# Altium schematic sheet 3 MXM Connector 1.SchDoc: MXM Connector
size C; DocumentNumber: 2; SheetNumber: 2; SheetTotal: 16
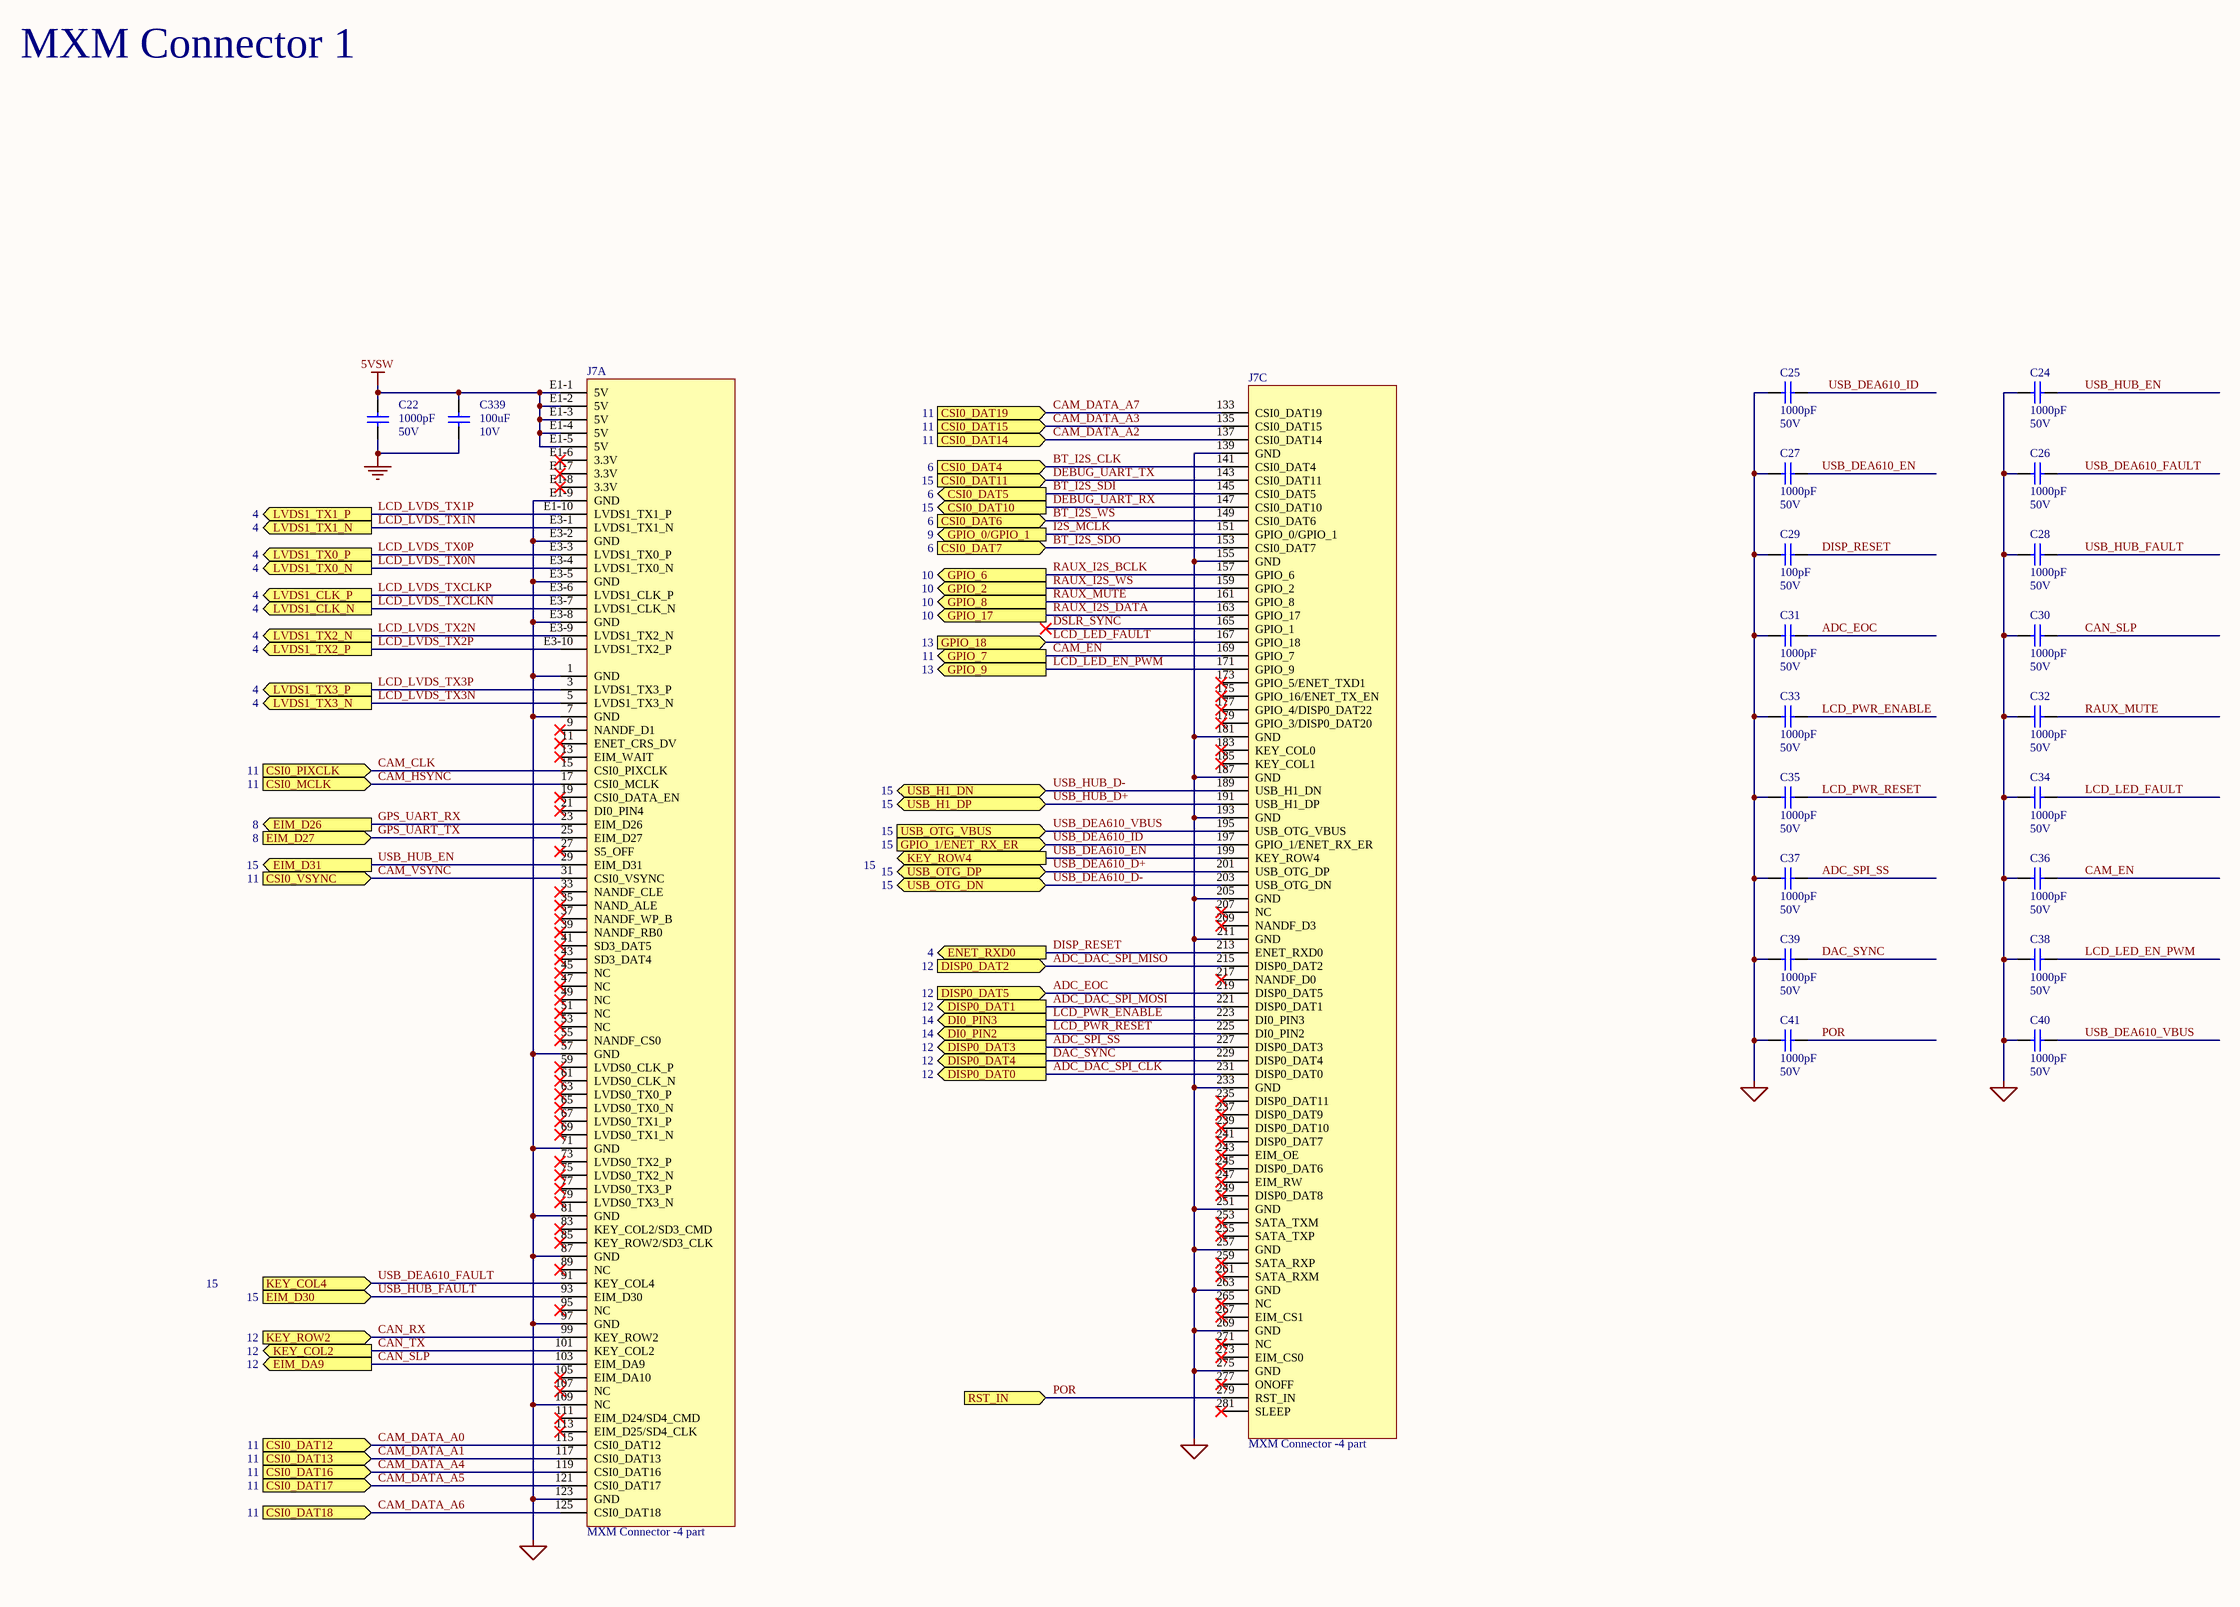
[diagram p0: 3 MXM Connector 1.SchDoc]

## Parts
C22  value 1000pF  Voltage: 50V  [CAP_0603]  (hidden comment: Cap 1000pF 50V 0603)
C24  value 1000pF  Voltage: 50V  [CAP_0603]  (hidden comment: Cap 1000pF 50V 0603)
C25  value 1000pF  Voltage: 50V  [CAP_0603]  (hidden comment: Cap 1000pF 50V 0603)
C26  value 1000pF  Voltage: 50V  [CAP_0603]  (hidden comment: Cap 1000pF 50V 0603)
C27  value 1000pF  Voltage: 50V  [CAP_0603]  (hidden comment: Cap 1000pF 50V 0603)
C28  value 1000pF  Voltage: 50V  [CAP_0603]  (hidden comment: Cap 1000pF 50V 0603)
C29  value 100pF  Voltage: 50V  [CAP_0402]  (hidden comment: Cap 100pF 50V 0402)
C30  value 1000pF  Voltage: 50V  [CAP_0603]  (hidden comment: Cap 1000pF 50V 0603)
C31  value 1000pF  Voltage: 50V  [CAP_0603]  (hidden comment: Cap 1000pF 50V 0603)
C32  value 1000pF  Voltage: 50V  [CAP_0603]  (hidden comment: Cap 1000pF 50V 0603)
C33  value 1000pF  Voltage: 50V  [CAP_0603]  (hidden comment: Cap 1000pF 50V 0603)
C34  value 1000pF  Voltage: 50V  [CAP_0603]  (hidden comment: Cap 1000pF 50V 0603)
C35  value 1000pF  Voltage: 50V  [CAP_0603]  (hidden comment: Cap 1000pF 50V 0603)
C36  value 1000pF  Voltage: 50V  [CAP_0603]  (hidden comment: Cap 1000pF 50V 0603)
C37  value 1000pF  Voltage: 50V  [CAP_0603]  (hidden comment: Cap 1000pF 50V 0603)
C38  value 1000pF  Voltage: 50V  [CAP_0603]  (hidden comment: Cap 1000pF 50V 0603)
C39  value 1000pF  Voltage: 50V  [CAP_0603]  (hidden comment: Cap 1000pF 50V 0603)
C40  value 1000pF  Voltage: 50V  [CAP_0603]  (hidden comment: Cap 1000pF 50V 0603)
C41  value 1000pF  Voltage: 50V  [CAP_0603]  (hidden comment: Cap 1000pF 50V 0603)
C339  value 100uF  Voltage: 10V  [CAP_1210]  (hidden comment: Cap 100uF 10V 1210)
J7  MXM Connector -4 part  [CON_CLE9990-0402F]  (parts A,C of 4)

## Ports
CSI0_DAT4 (in, see 6), CSI0_DAT5 (out, see 6), CSI0_DAT6 (in, see 6), CSI0_DAT7 (in, see 6), CSI0_DAT10 (out, see 15), CSI0_DAT11 (in, see 15), CSI0_DAT12 (in, see 11), CSI0_DAT13 (in, see 11), CSI0_DAT14 (in, see 11), CSI0_DAT15 (in, see 11), CSI0_DAT16 (in, see 11), CSI0_DAT17 (in, see 11), CSI0_DAT18 (in, see 11), CSI0_DAT19 (in, see 11), CSI0_MCLK (in, see 11), CSI0_PIXCLK (in, see 11), CSI0_VSYNC (in, see 11), DI0_PIN2 (out, see 14), DI0_PIN3 (out, see 14), DISP0_DAT0 (out, see 12), DISP0_DAT1 (out, see 12), DISP0_DAT2 (in, see 12), DISP0_DAT3 (out, see 12), DISP0_DAT4 (out, see 12), DISP0_DAT5 (in, see 12), EIM_D26 (out, see 8), EIM_D27 (in, see 8), EIM_D30 (in, see 15), EIM_D31 (out, see 15), EIM_DA9 (out, see 12), ENET_RXD0 (out, see 4), GPIO_0/GPIO_1 (out, see 9), GPIO_1/ENET_RX_ER (in, see 15), GPIO_2 (out, see 10), GPIO_6 (out, see 10), GPIO_7 (out, see 11), GPIO_8 (out, see 10), GPIO_9 (out, see 13), GPIO_17 (out, see 10), GPIO_18 (in, see 13), KEY_COL2 (out, see 12), KEY_COL4 (in, see 15), KEY_ROW2 (in, see 12), KEY_ROW4 (out, see 15), LVDS1_CLK_N (out, see 4), LVDS1_CLK_P (out, see 4), LVDS1_TX0_N (out, see 4), LVDS1_TX0_P (out, see 4), LVDS1_TX1_N (out, see 4), LVDS1_TX1_P (out, see 4), LVDS1_TX2_N (out, see 4), LVDS1_TX2_P (out, see 4), LVDS1_TX3_N (out, see 4), LVDS1_TX3_P (out, see 4), RST_IN (in), USB_H1_DN (bidir, see 15), USB_H1_DP (bidir, see 15), USB_OTG_DN (bidir, see 15), USB_OTG_DP (bidir, see 15), USB_OTG_VBUS (in, see 15)

## Nets
5VSW: C22.1 C339.1 J7.E1-1(5V) J7.E1-2(5V) J7.E1-3(5V) J7.E1-4(5V) J7.E1-5(5V)
GND: C22.2 C24.2 C25.2 C26.2 C27.2 C28.2 C29.2 C30.2 C31.2 C32.2 C33.2 C34.2 C35.2 C36.2 C37.2 C38.2 C39.2 C40.2 C41.2 C339.2 J7.1(GND) J7.7(GND) J7.57(GND) J7.71(GND) J7.81(GND) J7.87(GND) J7.97(GND) J7.109(NC) J7.123(GND) J7.139(GND) J7.155(GND) J7.181(GND) J7.187(GND) J7.193(GND) J7.205(GND) J7.211(GND) J7.233(GND) J7.251(GND) J7.257(GND) J7.263(GND) J7.269(GND) J7.275(GND) J7.E1-9(GND) J7.E3-2(GND) J7.E3-5(GND) J7.E3-8(GND)
ADC_DAC_SPI_CLK: J7.231(DISP0_DAT0) ; port DISP0_DAT0
ADC_DAC_SPI_MISO: J7.215(DISP0_DAT2) ; port DISP0_DAT2
ADC_DAC_SPI_MOSI: J7.221(DISP0_DAT1) ; port DISP0_DAT1
ADC_EOC: C31.1 J7.219(DISP0_DAT5) ; port DISP0_DAT5
ADC_SPI_SS: C37.1 J7.227(DISP0_DAT3) ; port DISP0_DAT3
BT_I2S_CLK: J7.141(CSI0_DAT4) ; port CSI0_DAT4
BT_I2S_SDI: J7.145(CSI0_DAT5) ; port CSI0_DAT5
BT_I2S_SDO: J7.153(CSI0_DAT7) ; port CSI0_DAT7
BT_I2S_WS: J7.149(CSI0_DAT6) ; port CSI0_DAT6
CAM_CLK: J7.15(CSI0_PIXCLK) ; port CSI0_PIXCLK
CAM_DATA_A0: J7.115(CSI0_DAT12) ; port CSI0_DAT12
CAM_DATA_A1: J7.117(CSI0_DAT13) ; port CSI0_DAT13
CAM_DATA_A2: J7.137(CSI0_DAT14) ; port CSI0_DAT14
CAM_DATA_A3: J7.135(CSI0_DAT15) ; port CSI0_DAT15
CAM_DATA_A4: J7.119(CSI0_DAT16) ; port CSI0_DAT16
CAM_DATA_A5: J7.121(CSI0_DAT17) ; port CSI0_DAT17
CAM_DATA_A6: J7.125(CSI0_DAT18) ; port CSI0_DAT18
CAM_DATA_A7: J7.133(CSI0_DAT19) ; port CSI0_DAT19
CAM_EN: C36.1 J7.169(GPIO_7) ; port GPIO_7
CAM_HSYNC: J7.17(CSI0_MCLK) ; port CSI0_MCLK
CAM_VSYNC: J7.31(CSI0_VSYNC) ; port CSI0_VSYNC
CAN_RX: J7.99(KEY_ROW2) ; port KEY_ROW2
CAN_SLP: C30.1 J7.103(EIM_DA9) ; port EIM_DA9
CAN_TX: J7.101(KEY_COL2) ; port KEY_COL2
DAC_SYNC: C39.1 J7.229(DISP0_DAT4) ; port DISP0_DAT4
DEBUG_UART_RX: J7.147(CSI0_DAT10) ; port CSI0_DAT10
DEBUG_UART_TX: J7.143(CSI0_DAT11) ; port CSI0_DAT11
DISP_RESET: C29.1 J7.213(ENET_RXD0) ; port ENET_RXD0
DSLR_SYNC: J7.165(GPIO_1)
GPS_UART_RX: J7.23(EIM_D26) ; port EIM_D26
GPS_UART_TX: J7.25(EIM_D27) ; port EIM_D27
I2S_MCLK: J7.151(GPIO_0/GPIO_1) ; port GPIO_0/GPIO_1
LCD_LED_EN_PWM: C38.1 J7.171(GPIO_9) ; port GPIO_9
LCD_LED_FAULT: C34.1 J7.167(GPIO_18) ; port GPIO_18
LCD_LVDS_TX0N: J7.E3-4(LVDS1_TX0_N) ; port LVDS1_TX0_N
LCD_LVDS_TX0P: J7.E3-3(LVDS1_TX0_P) ; port LVDS1_TX0_P
LCD_LVDS_TX1N: J7.E3-1(LVDS1_TX1_N) ; port LVDS1_TX1_N
LCD_LVDS_TX1P: J7.E1-10(LVDS1_TX1_P) ; port LVDS1_TX1_P
LCD_LVDS_TX2N: J7.E3-9(LVDS1_TX2_N) ; port LVDS1_TX2_N
LCD_LVDS_TX2P: J7.E3-10(LVDS1_TX2_P) ; port LVDS1_TX2_P
LCD_LVDS_TX3N: J7.5(LVDS1_TX3_N) ; port LVDS1_TX3_N
LCD_LVDS_TX3P: J7.3(LVDS1_TX3_P) ; port LVDS1_TX3_P
LCD_LVDS_TXCLKN: J7.E3-7(LVDS1_CLK_N) ; port LVDS1_CLK_N
LCD_LVDS_TXCLKP: J7.E3-6(LVDS1_CLK_P) ; port LVDS1_CLK_P
LCD_PWR_ENABLE: C33.1 J7.223(DI0_PIN3) ; port DI0_PIN3
LCD_PWR_RESET: C35.1 J7.225(DI0_PIN2) ; port DI0_PIN2
POR: C41.1 J7.279(RST_IN) ; port RST_IN
RAUX_I2S_BCLK: J7.157(GPIO_6) ; port GPIO_6
RAUX_I2S_DATA: J7.163(GPIO_17) ; port GPIO_17
RAUX_I2S_WS: J7.159(GPIO_2) ; port GPIO_2
RAUX_MUTE: C32.1 J7.161(GPIO_8) ; port GPIO_8
USB_DEA610_D+: J7.201(USB_OTG_DP) ; port USB_OTG_DP
USB_DEA610_D-: J7.203(USB_OTG_DN) ; port USB_OTG_DN
USB_DEA610_EN: C27.1 J7.199(KEY_ROW4) ; port KEY_ROW4
USB_DEA610_FAULT: C26.1 J7.91(KEY_COL4) ; port KEY_COL4
USB_DEA610_ID: C25.1 J7.197(GPIO_1/ENET_RX_ER) ; port GPIO_1/ENET_RX_ER
USB_DEA610_VBUS: C40.1 J7.195(USB_OTG_VBUS) ; port USB_OTG_VBUS
USB_HUB_D+: J7.191(USB_H1_DP) ; port USB_H1_DP
USB_HUB_D-: J7.189(USB_H1_DN) ; port USB_H1_DN
USB_HUB_EN: C24.1 J7.29(EIM_D31) ; port EIM_D31
USB_HUB_FAULT: C28.1 J7.93(EIM_D30) ; port EIM_D30

Not connected (* = marked no-connect by the designer): J7 9(NANDF_D1)* 11(ENET_CRS_DV)* 13(EIM_WAIT)* 19(CSI0_DATA_EN)* 21(DI0_PIN4)* 27(S5_OFF)* 33(NANDF_CLE)* 35(NAND_ALE)* 37(NANDF_WP_B)* 39(NANDF_RB0)* 41(SD3_DAT5)* 43(SD3_DAT4)* 45(NC)* 47(NC)* 49(NC)* 51(NC)* 53(NC)* 55(NANDF_CS0)* 59(LVDS0_CLK_P)* 61(LVDS0_CLK_N)* 63(LVDS0_TX0_P)* 65(LVDS0_TX0_N)* 67(LVDS0_TX1_P)* 69(LVDS0_TX1_N)* 73(LVDS0_TX2_P)* 75(LVDS0_TX2_N)* 77(LVDS0_TX3_P)* 79(LVDS0_TX3_N)* 83(KEY_COL2/SD3_CMD)* 85(KEY_ROW2/SD3_CLK)* 89(NC)* 95(NC)* 105(EIM_DA10)* 107(NC)* 111(EIM_D24/SD4_CMD)* 113(EIM_D25/SD4_CLK)* 173(GPIO_5/ENET_TXD1)* 175(GPIO_16/ENET_TX_EN)* 177(GPIO_4/DISP0_DAT22)* 179(GPIO_3/DISP0_DAT20)* 183(KEY_COL0)* 185(KEY_COL1)* 207(NC)* 209(NANDF_D3)* 217(NANDF_D0)* 235(DISP0_DAT11)* 237(DISP0_DAT9)* 239(DISP0_DAT10)* 241(DISP0_DAT7)* 243(EIM_OE)* 245(DISP0_DAT6)* 247(EIM_RW)* 249(DISP0_DAT8)* 253(SATA_TXM)* 255(SATA_TXP)* 259(SATA_RXP)* 261(SATA_RXM)* 265(NC)* 267(EIM_CS1)* 271(NC)* 273(EIM_CS0)* 277(ONOFF)* 281(SLEEP)* E1-6(3.3V)* E1-7(3.3V)* E1-8(3.3V)*

## Notes on the sheet
- MXM Connector 1
- First View Consultants
- Austin, Tx
- 512.582.9102
- Drawn:
- Title:
- Sheet
- of
- firstviewconsultants.com
- FVC #:
- Checked:
- Approved:
- Date:
- File:
- Rev.
- Time:

## Library data of the parts
C22 C24-C28 C30-C41 = Cap 1000pF 50V 0603: Cap, Cer, 1000pF, 50V, 10%, X7S, 0603; Manufacturer: Yageo; Manufacturer #: CC0603KRX7R9BB102; Have Footprint: yes; Tolerance: 10%; PACKAGE: 0402
C29 = Cap 100pF 50V 0402: Cap, Cer, 100pF, 50V, 5%, C0G/NP0, 0402; Manufacturer #: CC0402JRNPO9BN101; Manufacturer: Yageo; Have Footprint: yes; PACKAGE: 0402; Tolerance: 5%
C339 = Cap 100uF 10V 1210: Cap, Cer, 100uF, 10V, 20%, X5R, 1210; Manufacturer #: C1210C107M8PACTU; Manufacturer: Kemet; Package: 1210
J7 = MXM Connector -4 part: Conn, 314-pin, SOM i.MX6, SMD; Manufacturer #: CLE9990-0402F; Manufacturer: SMK Electronics; Operating Temperature: -40℃ ~ +105℃